# Altium schematic sheet Sheet1.SchDoc
size A4
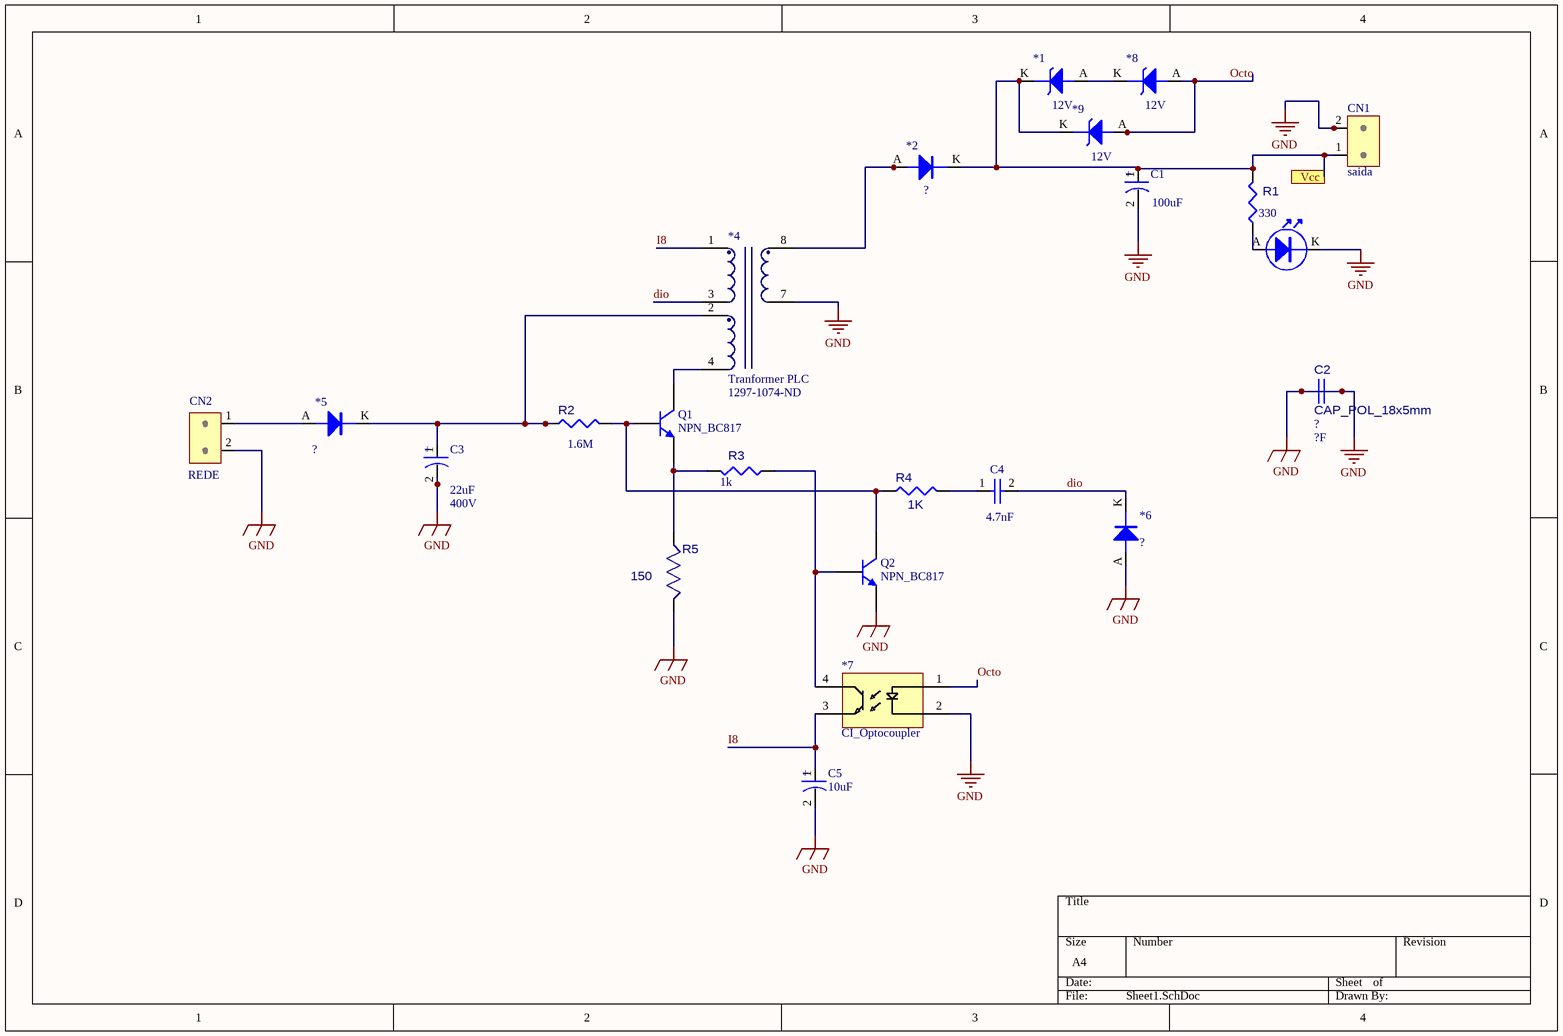
[diagram p0: Sheet1.SchDoc]

## Parts
*1  value 12V  [DIO_PTH_DO35]  (hidden comment: DIO_ZENER_DO35)
*2  DIO_PTH_1N4007  [DIO_PTH_DO41]  (value not drawn)
*3  LED_AXIAL_5MM  [LED_Axial_5mm]  (value not drawn)
*4  Tranformer PLC  Supplier Part Number 1: 1297-1074-ND  [DIV_TRAFO PLC]
*5  DIO_SMD_1N4148  [DIO_PTH_DO41]  (value not drawn)
*6  DIO_PTH_1N4007  [DIO_PTH_DO41]  (value not drawn)
*7  CI_Optocoupler  [SFH6106]
*8  value 12V  [DIO_PTH_DO35]  (hidden comment: DIO_ZENER_DO35)
*9  value 12V  [DIO_PTH_DO35]  (hidden comment: DIO_ZENER_DO35)
C1  value 100uF  [CAP_ALU_RADIAL_5MM]  (hidden comment: Electrolytic Capacitor)
C2  ?F  [CAP_POL_18x5mm]
C3  value 22uF  Tensão: 400V  [CAP_ALU_RADIAL_5MM]  (hidden comment: Electrolytic Capacitor)
C4  value 4.7nF  [CAP_POL_RADIAL_16MM]  (hidden comment: CAP_POL_RADIAL_16MM)
C5  10uF  [CAP_ALU_RADIAL_5MM]
CN1  saida  [CN_KRE_2]
CN2  Footprint: REDE  [CN_KRE_2]  (hidden comment: ?)
Q1  NPN_BC817  [HEADER_1X3]
Q2  NPN_BC817  [HEADER_1X3]
R1  330  [RES_PTH_7.62MM]
R2  1.6M  [RES_PTH_7.62MM]
R3  1k  [RES_PTH_7.62MM]
R4  Footprint: 1K  [RES_PTH_7.62MM]  (hidden comment: ?)
R5  Footprint: 150  [RES-7.62mm]  (hidden comment: *)

## Ports
Vcc

## Nets
GND: *3.K *4.7 *6.A *7.2(C) C1.2 C2.1 C2.2 C3.2 C5.2 CN1.2 CN2.2 Q2.2(E) R5.2
dio: *4.3 *6.K C4.2
I8: *4.1 *7.3(C) C5.1
Octo: *7.1(A) *8.A *9.A
Vcc: *1.K *2.K *9.K C1.1 CN1.1 R1.2 ; port Vcc
Net*1_A: *1.A *8.K
Net*2_A: *2.A *4.8
Net*3_A: *3.A R1.1
Net*4_2: *4.2 *5.K C3.1 R2.1
Net*4_4: *4.4 Q1.3(C)
Net*5_A: *5.A CN2.1
Net*7_4: *7.4(E) Q2.1(B) R3.1
NetC4_1: C4.1 R4.2
NetQ1_1: Q1.1(B) Q2.3(C) R2.2 R4.1
NetQ1_2: Q1.2(E) R3.2 R5.1

## Notes on the sheet
- (in symbol CAP_ALU_RADIAL_5MM) +

## Library data of the parts
C1 C3 = CAP_ALU_RADIAL_5MM: PTH Radial Electrolytic Capacitor
  C1: Tensão: ?
C2 = CAP_CER_POLI_18x5mm: SMD Ceramic Capacitor; Tensão: ?; Value: ?F
C4 = CAP_POL_RADIAL_16MM: PTH Radial Polyester Capacitor; Tensão: ?
C5 = CAP_ALU_RADIAL_5MM: PTH Radial Electrolytic Capacitor; Value: ?F; Tensão: ?
CN1 CN2 = CN_MKDS_2: MKDS_2; Value: ?
Q2 = NPN_BC817: pin to pad: 1>2 2>1
R1-R4 = RES_PTH_7.62MM: Pin Through Hole Resistor 7.62mm
  R1: Value: 330
  R2: Value: 1.6M
  R3: Value: 1k
  R4: Value: ?
R5 = RES_PTH300: Pin Through Hole Resistor 300mils/7.62mm; Value: *
*2 *6 = DIO_PTH_1N4007: Value: ?
*3 = LED_AXIAL_5MM: Value: ?
*4 = Tranformer PLC: Supplier 1: Digi-Key
*5 = DIO_SMD_1N4148: Value: ?